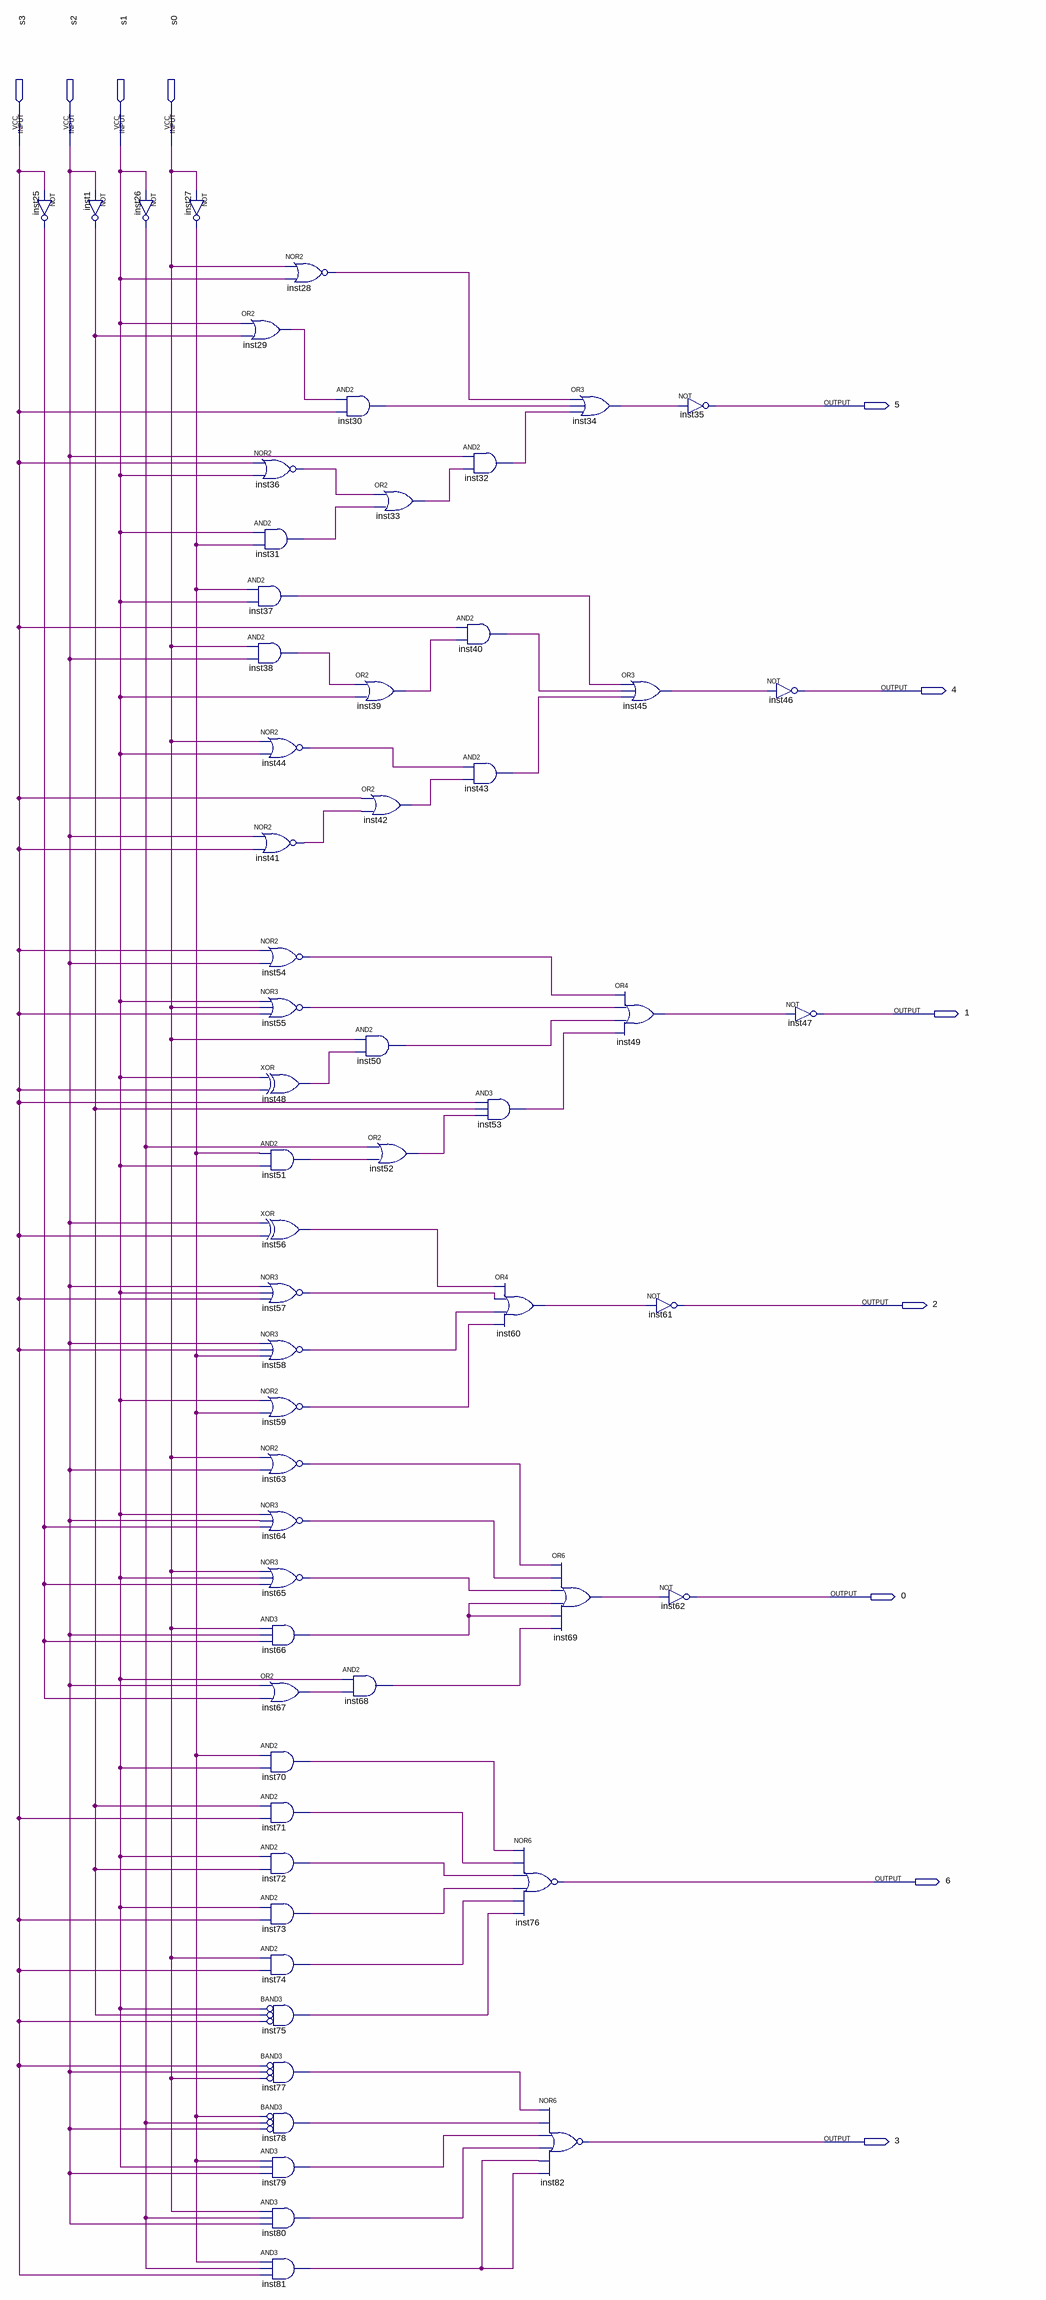
[diagram p0: schematic sheet]
// Quartus schematic display.bdf as structural Verilog: 59 symbols, 11 pins
module display (
  input  s3,
  input  s2,
  input  s1,
  input  s0,
  output \5 ,
  output \4 ,
  output \1 ,
  output \2 ,
  output \0 ,
  output \6 ,
  output \3 
);

  wire inst1_out, inst25_out, inst26_out, inst27_out, inst28_out, inst29_out, inst30_out, inst31_out,
       inst32_out, inst33_out, inst34_out, inst36_out, inst37_out, inst38_out, inst39_out, inst40_out,
       inst41_out, inst42_out, inst43_out, inst44_out, inst45_out, inst48_out, inst49_out, inst50_out,
       inst51_out, inst52_out, inst53_out, inst54_out, inst55_out, inst56_out, inst57_out, inst58_out,
       inst59_out, inst60_out, inst63_out, inst64_out, inst65_out, inst66_out, inst67_out, inst68_out,
       inst69_out, inst70_out, inst71_out, inst72_out, inst73_out, inst74_out, inst75_out, inst77_out,
       inst78_out, inst79_out, inst80_out, inst81_out;

  not inst25 (inst25_out, s3);
  not inst1 (inst1_out, s2);
  not inst26 (inst26_out, s1);
  not inst27 (inst27_out, s0);
  or inst29 (inst29_out, s1, inst1_out);
  nor inst28 (inst28_out, s0, s1);
  nor inst36 (inst36_out, s3, s1);
  and inst31 (inst31_out, s1, inst27_out);
  and inst37 (inst37_out, inst27_out, s1);
  and inst38 (inst38_out, s0, s2);
  nor inst44 (inst44_out, s0, s1);
  nor inst41 (inst41_out, s2, s3);
  nor inst54 (inst54_out, s3, s2);
  nor inst55 (inst55_out, s1, s0, s3);
  xor inst48 (inst48_out, s1, s3);
  and inst51 (inst51_out, inst27_out, s1);
  xor inst56 (inst56_out, s2, s3);
  nor inst57 (inst57_out, s2, s1, s3);
  nor inst58 (inst58_out, s2, s3, inst27_out);
  nor inst59 (inst59_out, s1, inst27_out);
  nor inst63 (inst63_out, s0, s2);
  nor inst64 (inst64_out, s1, s2, inst25_out);
  nor inst65 (inst65_out, s0, s1, inst25_out);
  and inst66 (inst66_out, s0, s2, inst25_out);
  or inst67 (inst67_out, s2, inst25_out);
  and inst70 (inst70_out, inst27_out, s1);
  and inst71 (inst71_out, inst1_out, s3);
  and inst72 (inst72_out, s1, inst1_out);
  and inst73 (inst73_out, s1, s3);
  and inst74 (inst74_out, s0, s3);
  and inst75 (inst75_out, ~s1, ~inst1_out, ~s3);  // BAND3
  and inst77 (inst77_out, ~s3, ~s2, ~s0);  // BAND3
  and inst78 (inst78_out, ~inst27_out, ~inst26_out, ~s2);  // BAND3
  and inst79 (inst79_out, inst27_out, s1, s2);
  and inst80 (inst80_out, s0, inst26_out, s2);
  and inst81 (inst81_out, inst27_out, inst26_out, s3);
  and inst30 (inst30_out, inst29_out, s3);
  and inst68 (inst68_out, s1, inst67_out);
  or inst33 (inst33_out, inst36_out, inst31_out);
  or inst39 (inst39_out, inst38_out, s1);
  or inst42 (inst42_out, s3, inst41_out);
  and inst50 (inst50_out, s0, inst48_out);
  or inst52 (inst52_out, inst26_out, inst51_out);
  and inst32 (inst32_out, s2, inst33_out);
  and inst40 (inst40_out, s3, inst39_out);
  and inst43 (inst43_out, inst44_out, inst42_out);
  and inst53 (inst53_out, s3, inst1_out, inst52_out);
  or inst60 (inst60_out, inst56_out, inst57_out, inst58_out, inst59_out);
  nor inst76 (\6 , inst70_out, inst71_out, inst72_out, inst73_out, inst74_out, inst75_out);
  nor inst82 (\3 , inst77_out, inst78_out, inst79_out, inst80_out, inst81_out, inst81_out);
  or inst34 (inst34_out, inst28_out, inst30_out, inst32_out);
  or inst69 (inst69_out, inst63_out, inst64_out, inst65_out, inst66_out, inst66_out, inst68_out);
  or inst45 (inst45_out, inst37_out, inst40_out, inst43_out);
  or inst49 (inst49_out, inst54_out, inst55_out, inst50_out, inst53_out);
  not inst61 (\2 , inst60_out);
  not inst35 (\5 , inst34_out);
  not inst62 (\0 , inst69_out);
  not inst46 (\4 , inst45_out);
  not inst47 (\1 , inst49_out);
endmodule
